# EAGLE design Panel (EAGLE 6.3)

## Sheet 1 of 2
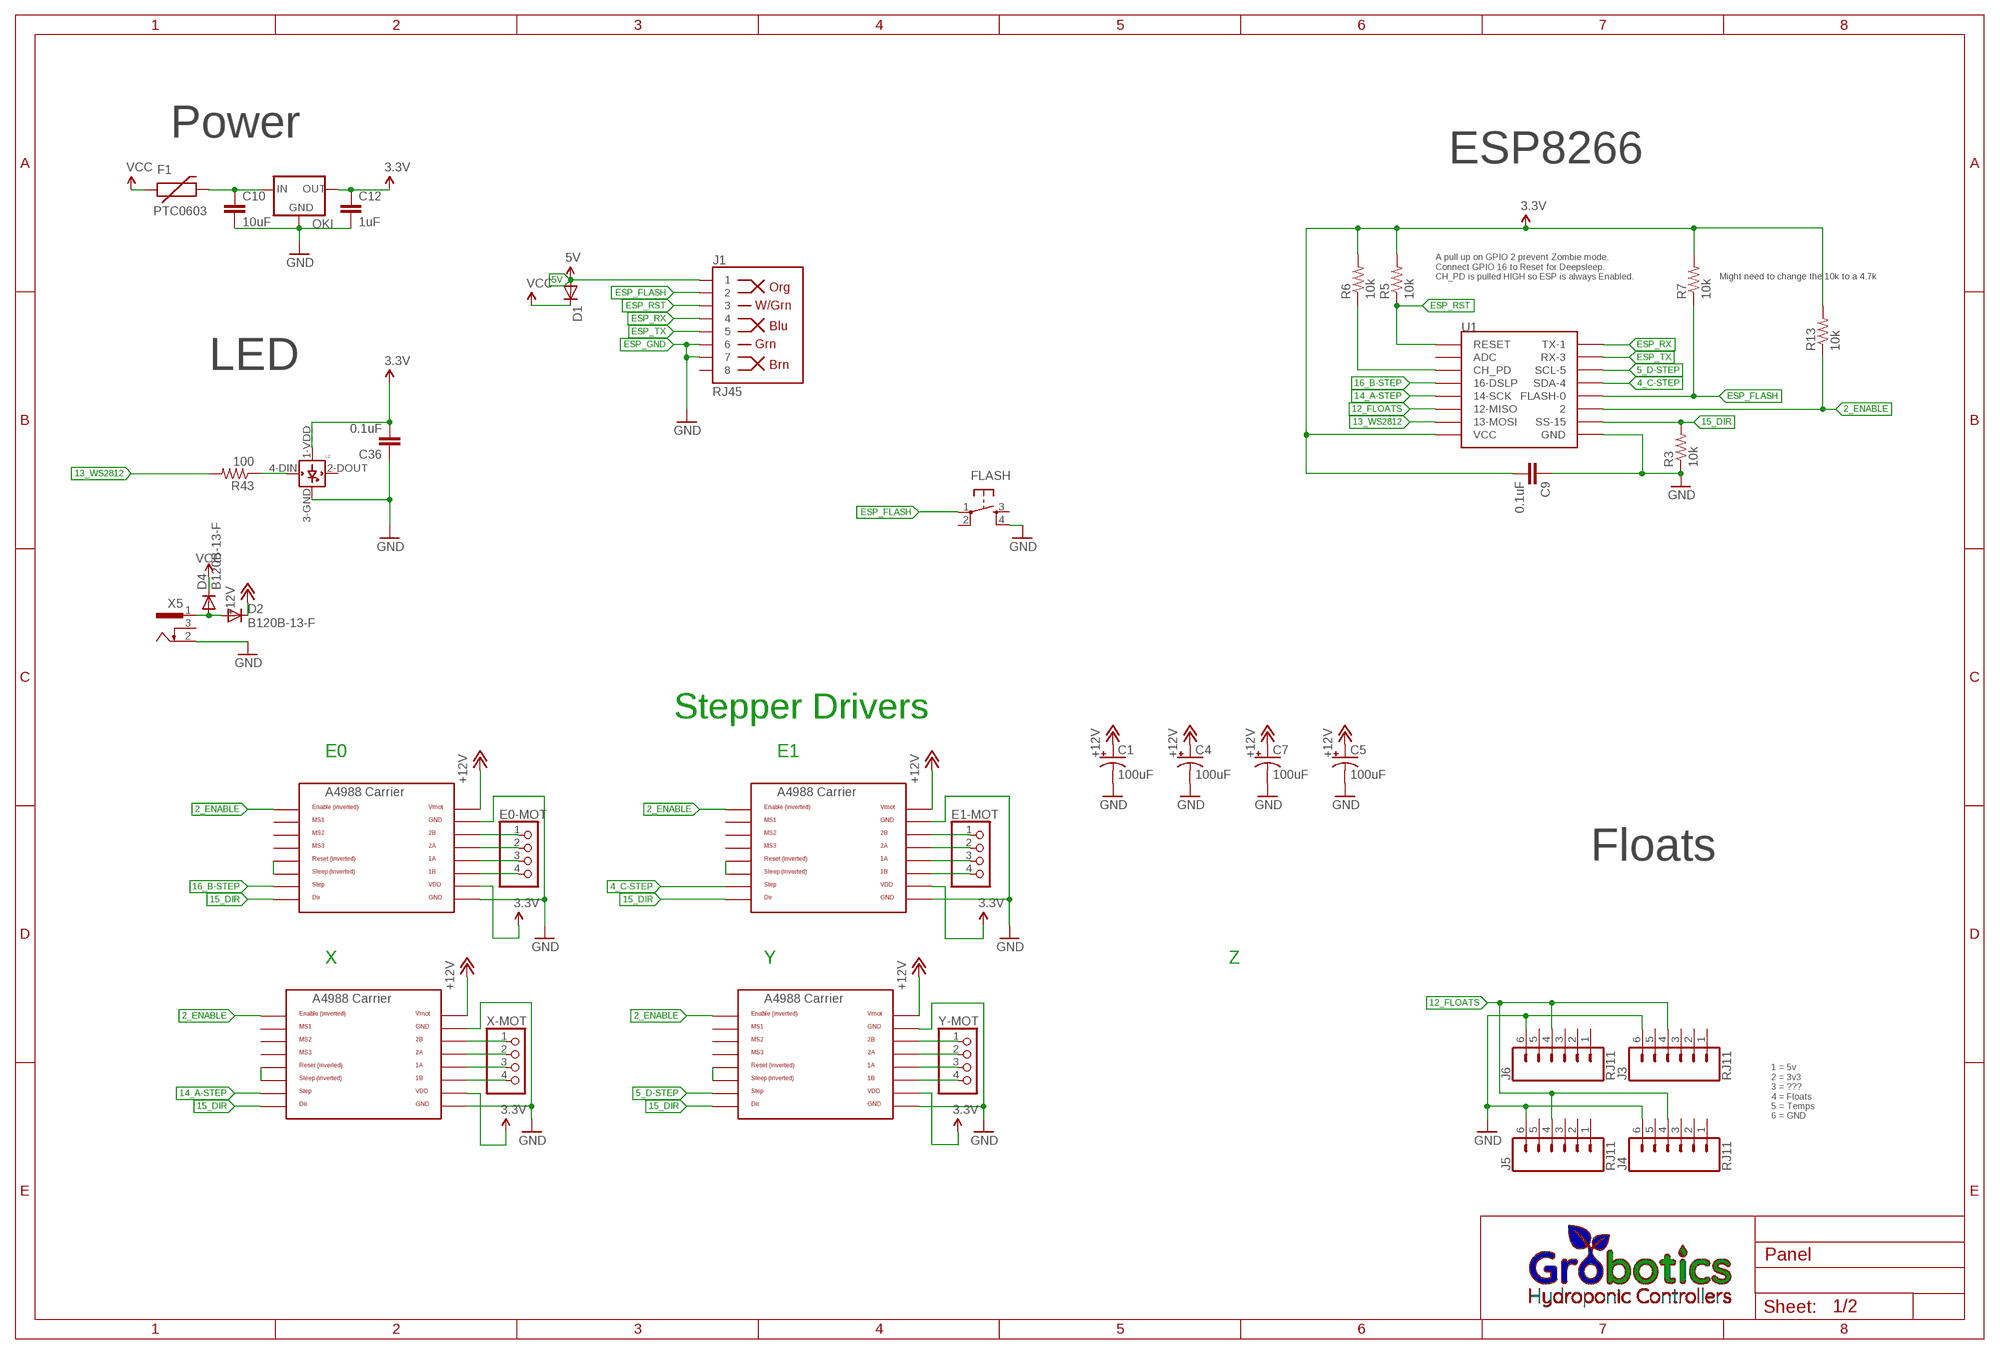
[diagram p0: schematic, sheet 1]

### Parts
C1  100uF  CPOL-US153CLV-0605  [153CLV-0605]
C4  100uF  CPOL-US153CLV-0605  [153CLV-0605]
C5  100uF  CPOL-US153CLV-0605  [153CLV-0605]
C7  100uF  CPOL-US153CLV-0605  [153CLV-0605]
C9  0.1uF  CAP0805  [0805]
C10  10uF  CAP1206  [1206]
C12  1uF  CAP0805  [0805]
C36  0.1uF  CAP0805  [0805]
D1  DIODESOD  [SOD-323]
D2  B120B-13-F  DIODESMB  [SMB-DIODE]
D4  B120B-13-F  DIODESMB  [SMB-DIODE]
E0-MOT  PINHD-1X4  [1X04]
E1-MOT  PINHD-1X4  [1X04]
F1  PTC0603  [0603]
FLASH  TAC_SWITCHSMD  [TACTILE_SWITCH_SMD]
J1  RJ45  RJ45-8  [RJ45-8]
J3  RJ11  RJ11-6  [RJ11-6]
J4  RJ11  RJ11-6  [RJ11-6]
J5  RJ11  RJ11-6  [RJ11-6]
J6  RJ11  RJ11-6  [RJ11-6]
L2  WS2812B  [WS2812B]
OKI  78XXS  [78XXS]
R3  10k  RESISTOR0805  [0805]
R5  10k  RESISTOR0805  [0805]
R6  10k  RESISTOR0805  [0805]
R7  10k  RESISTOR0805  [0805]
R13  10k  RESISTOR0805  [0805]
R43  100  RESISTOR0805  [0805]
U1  ESP12SMD  [ESP12-SMD]
U$1  A4988BREAKOUT  [A4988BREAKOUT]
U$2  LOGO_GROBOTICS-S  [GROBOTICS-S]
U$5  A4988BREAKOUT  [A4988BREAKOUT]
U$6  A4988BREAKOUT  [A4988BREAKOUT]
U$7  A4988BREAKOUT  [A4988BREAKOUT]
X5  733980-62  [733980-62]
X-MOT  PINHD-1X4  [1X04]
Y-MOT  PINHD-1X4  [1X04]

### Nets
2_ENABLE: R13.1 U1.GPIO2 U$1.EN U$5.EN U$6.EN U$7.EN
4_C-STEP: U1.GPIO4(SDA-4) U$5.STEP
5_D-STEP: U1.GPIO5(SCL-5) U$7.STEP
5V: D1.2(A) J1.1
12_FLOATS: J3.4 J4.4 J5.4 J6.4 U1.GPIO12(12-MISO)
13_WS2812: R43.2 U1.GPIO13(13-MOSI)
14_A-STEP: U1.GPIO14(14-SCK) U$6.STEP
15_DIR: R3.2 U1.GPIO15(SS-15) U$1.DIR U$5.DIR U$6.DIR U$7.DIR
16_B-STEP: U1.GPIO16(16-DSLP) U$1.STEP
+12V: C1.+ C4.+ C5.+ C7.+ D2.C U$1.VMOT U$5.VMOT U$6.VMOT U$7.VMOT
ESP_3.3V: C9.2 C12.1 C36.2 L2.1-VDD(VDD) OKI.OUT R5.2 R6.2 R7.2 R13.2 U1.VCC U$1.VDD U$5.VDD U$6.VDD U$7.VDD ; supply symbol labelled 3.3V
ESP_FLASH: FLASH.1 J1.2 R7.1 U1.GPIO0(FLASH-0)
ESP_GND: C1.- C4.- C5.- C7.- C9.1 C10.2 C12.2 C36.1 FLASH.4 J1.6 J1.7 J3.6 J4.6 J5.6 J6.6 L2.3-GND(GND) OKI.GND R3.1 U1.GND U$1.GND U$1.GND@0(GND) U$5.GND U$5.GND@0(GND) U$6.GND U$6.GND@0(GND) U$7.GND U$7.GND@0(GND) X5.2 ; supply symbol labelled GND
ESP_RST: J1.3 R5.1 U1.RESET
ESP_RX: J1.4 U1.TXD0(TX-1)
ESP_TX: J1.5 U1.RXD0(RX-3)
N$1: R6.1 U1.CH_PD
N$3: D2.A D4.A X5.1
N$9: U$1.RST U$1.SLP(SLEEP)
N$18: E0-MOT.1 U$1.2B
N$20: U$6.RST U$6.SLP(SLEEP)
N$21: E0-MOT.2 U$1.2A
N$22: E0-MOT.3 U$1.1A
N$23: U$7.RST U$7.SLP(SLEEP)
N$24: U$5.RST U$5.SLP(SLEEP)
N$26: E0-MOT.4 U$1.1B
N$27: E1-MOT.1 U$5.2B
N$28: E1-MOT.2 U$5.2A
N$32: E1-MOT.3 U$5.1A
N$36: E1-MOT.4 U$5.1B
N$37: U$6.2B X-MOT.1
N$38: U$6.2A X-MOT.2
N$39: U$6.1A X-MOT.3
N$40: U$6.1B X-MOT.4
N$41: U$7.2B Y-MOT.1
N$42: U$7.2A Y-MOT.2
N$43: U$7.1A Y-MOT.3
N$44: U$7.1B Y-MOT.4
N$45: C10.1 F1.2 OKI.IN
N$74: L2.4-DIN(DIN) R43.1
VCC: D1.1(C) D4.C F1.1
Unconnected: FLASH.2 FLASH.3 J1.8 J3.1 J3.2 J3.3 J3.5 J4.1 J4.2 J4.3 J4.5 J5.1 J5.2 J5.3 J5.5 J6.1 J6.2 J6.3 J6.5 L2.2-DOUT(DOUT) U1.ADC U$1.MS1 U$1.MS2 U$1.MS3 U$5.MS1 U$5.MS2 U$5.MS3 U$6.MS1 U$6.MS2 U$6.MS3 U$7.MS1 U$7.MS2 U$7.MS3 X5.3

### Notes on the sheet
- Power
- ESP8266
- A pull up on GPIO 2 prevent Zombie mode.
  Connect GPIO 16 to Reset for Deepsleep.
  CH_PD is pulled HIGH so ESP is always Enabled.
- Might need to change the 10k to a 4.7k
- LED
- Stepper Drivers
- E0 | E1
- Floats
- X | Y | Z
- 1 = 5v
  2 = 3v3
  3 = ???
  4 = Floats
  5 = Temps
  6 = GND

## Sheet 2 of 2
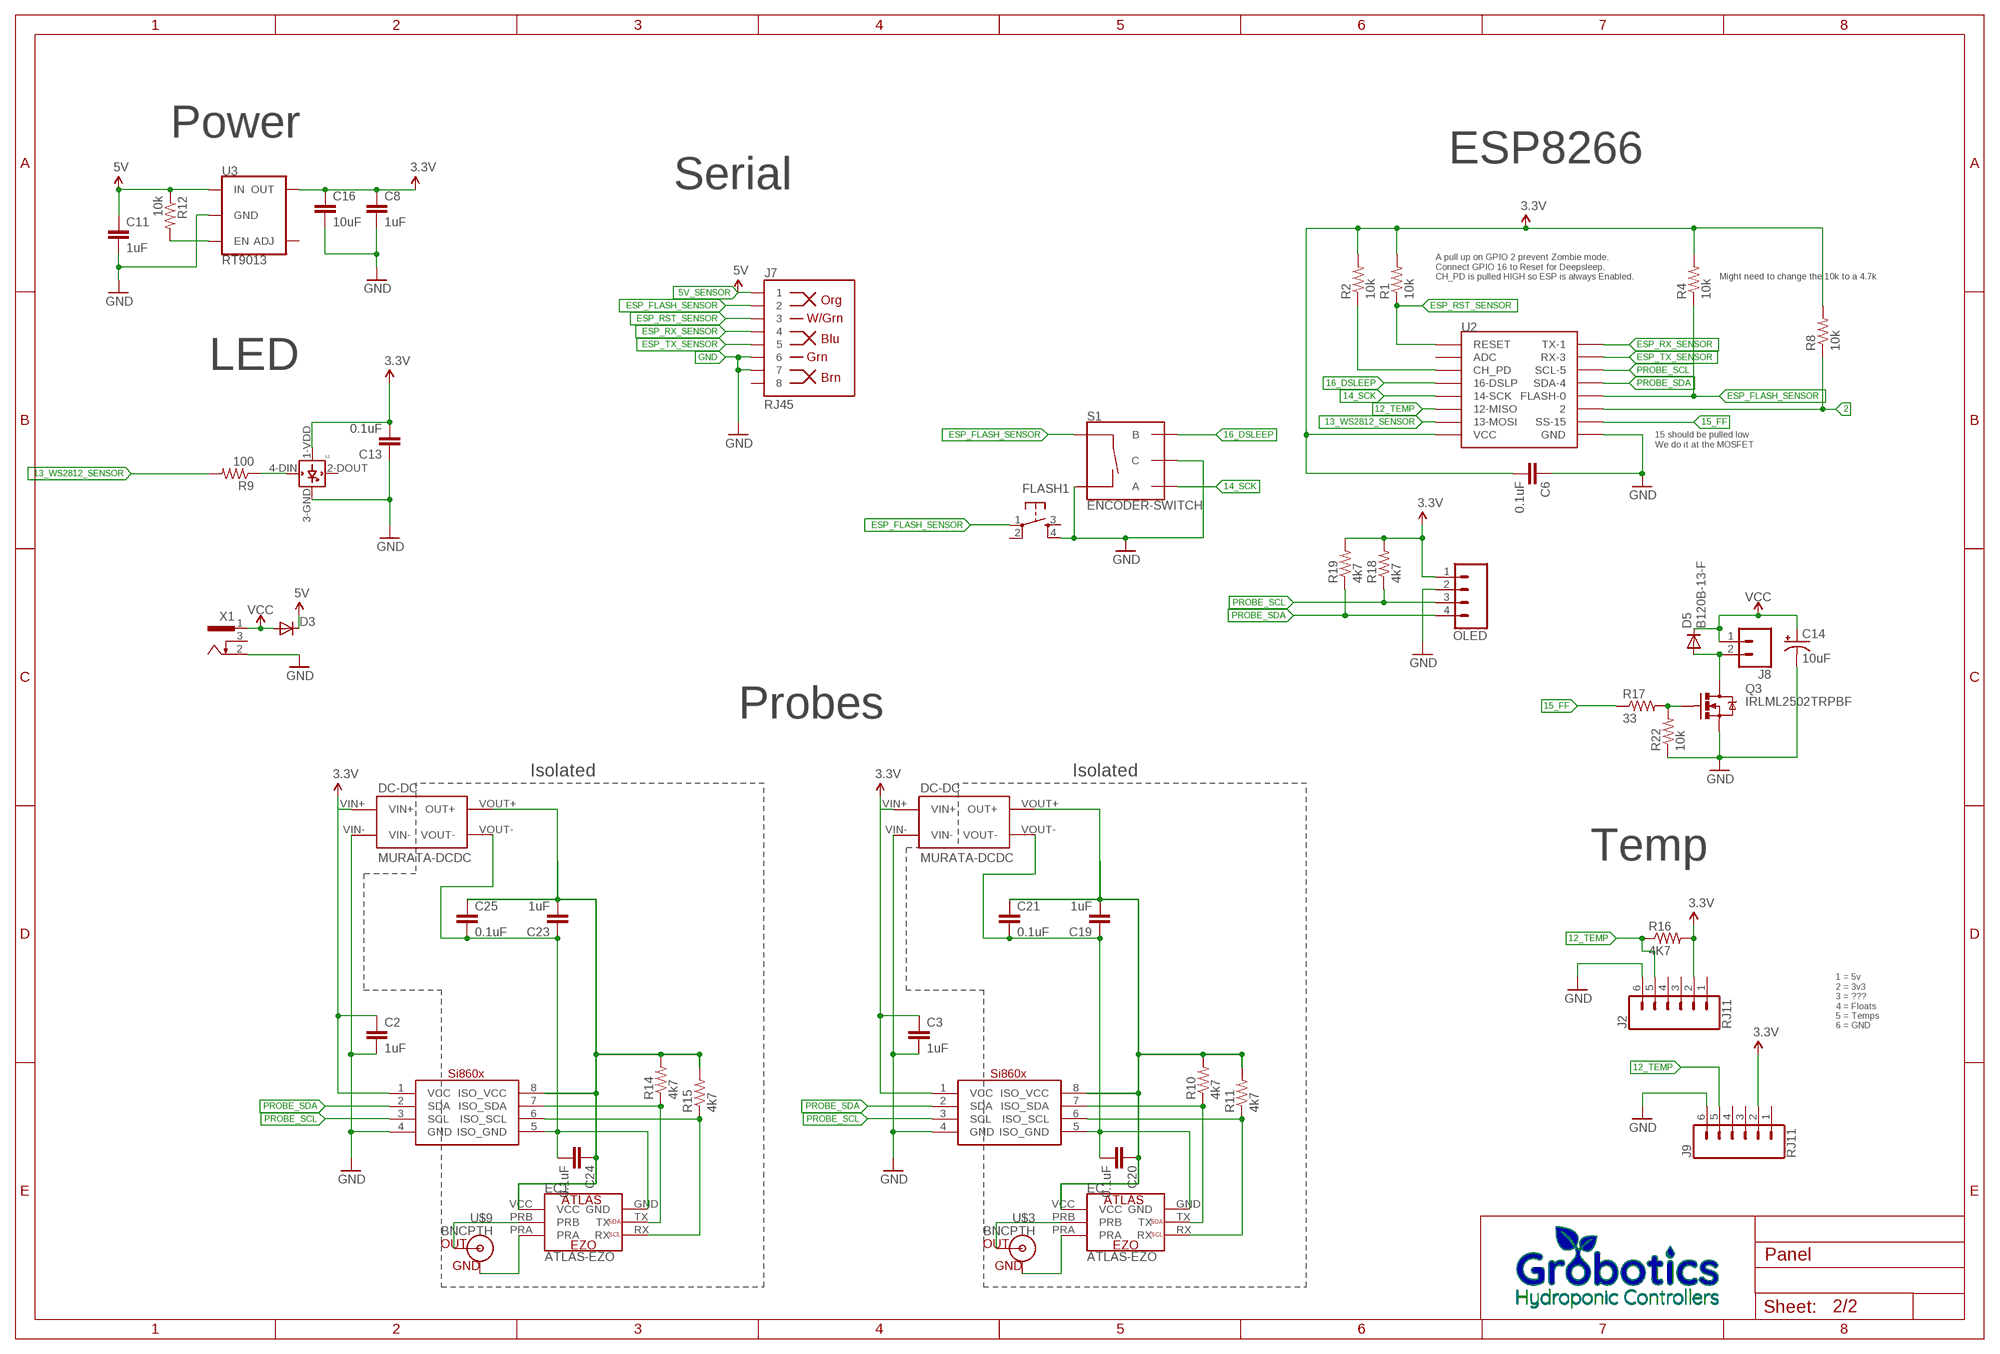
[diagram p1: schematic, sheet 2]

### Parts
C2  1uF  CAP0805  [0805]
C3  1uF  CAP0805  [0805]
C6  0.1uF  CAP0805  [0805]
C8  1uF  CAP0805  [0805]
C11  1uF  CAP0805  [0805]
C13  0.1uF  CAP0805  [0805]
C14  10uF  CPOL-US153CLV-0405  [153CLV-0405]
C16  10uF  CAP0805  [0805]
C19  1uF  CAP0805  [0805]
C20  0.1uF  CAP0805  [0805]
C21  0.1uF  CAP0805  [0805]
C23  1uF  CAP0805  [0805]
C24  0.1uF  CAP0805  [0805]
C25  0.1uF  CAP0805  [0805]
D3  DIODESOD  [SOD-323]
D5  B120B-13-F  DIODESMB  [SMB-DIODE]
EC  ATLAS-EZO  [ATLAS-EZO]
EC1  ATLAS-EZO  [ATLAS-EZO]
FLASH1  TAC_SWITCHSMD  [TACTILE_SWITCH_SMD]
J2  RJ11  RJ11-6  [RJ11-6]
J7  RJ45  RJ45-8  [RJ45-8]
J8  CONN_02  [1X02]
J9  RJ11  RJ11-6  [RJ11-6]
L1  WS2812B  [WS2812B]
OLED  CONN_04  [1X04]
Q3  IRLML2502TRPBF  MOSFET-NCHANNELSMD  [SOT23-3]
R1  10k  RESISTOR0805  [0805]
R2  10k  RESISTOR0805  [0805]
R4  10k  RESISTOR0805  [0805]
R8  10k  RESISTOR0805  [0805]
R9  100  RESISTOR0805  [0805]
R10  4k7  RESISTOR0805-RES  [0805]
R11  4k7  RESISTOR0805-RES  [0805]
R12  10k  RESISTOR0805  [0805]
R14  4k7  RESISTOR0805-RES  [0805]
R15  4k7  RESISTOR0805-RES  [0805]
R16  4K7  RESISTOR0805-RES  [0805]
R17  33  RESISTOR0805  [0805]
R18  4k7  RESISTOR0805  [0805]
R19  4k7  RESISTOR0805  [0805]
R22  10k  RESISTOR0805  [0805]
S1  ENCODER-SWITCH  [ROTARY_ENC_PLAIN]
U2  ESP12SMD  [ESP12-SMD]
U3  RT9013  AP2202-ADJ  [SOT23-5]
U$3  BNCPTH  [BNC]
U$4  MURATA-DCDC  [MURATA_DCDC]
U$8  SI860X  [SO08]
U$9  BNCPTH  [BNC]
U$11  SI860X  [SO08]
U$12  LOGO_GROBOTICS  [GROBOTICS]
U$14  MURATA-DCDC  [MURATA_DCDC]
X1  733980-62  [733980-62]

### Nets
2: R8.1 U2.GPIO2
3.3V: C2.1 C3.1 C6.2 C8.1 C13.2 C16.1 J2.2 J9.2 L1.1-VDD(VDD) OLED.1 R1.2 R2.2 R4.2 R8.2 R16.2 R18.2 R19.2 U2.VCC U3.5(OUT) U$4.VIN+ U$8.1(VCC) U$11.1(VCC) U$14.VIN+
5V_SENSOR: C11.1 D3.1(C) J7.1 R12.1 U3.1(IN) ; supply symbol labelled 5V
12_TEMP: J2.5 J9.5 R16.1 U2.GPIO12(12-MISO)
13_WS2812_SENSOR: R9.2 U2.GPIO13(13-MOSI)
14_SCK: S1.A U2.GPIO14(14-SCK)
15_FF: R17.1 U2.GPIO15(SS-15)
16_DSLEEP: S1.B U2.GPIO16(16-DSLP)
ESP_FLASH_SENSOR: FLASH1.1 J7.2 R4.1 S1.SW+ U2.GPIO0(FLASH-0)
ESP_RST_SENSOR: J7.3 R1.1 U2.RESET
ESP_RX_SENSOR: J7.4 U2.TXD0(TX-1)
ESP_TX_SENSOR: J7.5 U2.RXD0(RX-3)
GND: C2.2 C3.2 C6.1 C8.2 C11.2 C13.1 C14.- C16.2 FLASH1.4 J2.6 J7.6 J7.7 J9.6 L1.3-GND(GND) OLED.2 Q3.2(S) R22.1 S1.C S1.SW- U2.GND U3.2(GND) U$4.VIN- U$8.4(GND) U$11.4(GND) U$14.VIN- X1.2
N$2: EC.PRB U$3.S(OUT)
N$4: EC1.PRB U$9.S(OUT)
N$5: EC1.PRA U$9.GND
N$6: EC1.RX R15.1 U$11.6(ISO_SCL)
N$7: EC1.TX R14.1 U$11.7(ISO_SDA)
N$8: EC.PRA U$3.GND
N$10: R2.1 U2.CH_PD
N$11: L1.4-DIN(DIN) R9.1
N$12: EC.RX R11.1 U$8.6(ISO_SCL)
N$13: R12.2 U3.3(EN)
N$14: EC.TX R10.1 U$8.7(ISO_SDA)
N$15: C19.1 C20.2 C21.2 EC.GND U$4.VOUT- U$8.5(ISO_GND)
N$16: C19.2 C20.1 C21.1 EC.VCC R10.2 R11.2 U$4.VOUT+(OUT+) U$8.8(ISO_VCC)
N$17: C23.1 C24.2 C25.2 EC1.GND U$11.5(ISO_GND) U$14.VOUT-
N$19: Q3.1(G) R17.2 R22.2
N$25: C23.2 C24.1 C25.1 EC1.VCC R14.2 R15.2 U$11.8(ISO_VCC) U$14.VOUT+(OUT+)
N$29 [power]: D5.A J8.2 Q3.3(D)
PROBE_SCL: OLED.3 R18.1 U2.GPIO5(SCL-5) U$8.3(SCL) U$11.3(SCL)
PROBE_SDA: OLED.4 R19.1 U2.GPIO4(SDA-4) U$8.2(SDA) U$11.2(SDA)
VCC_SENSOR: C14.+ D3.2(A) D5.C J8.1 X1.1 ; supply symbol labelled VCC
Unconnected: FLASH1.2 FLASH1.3 J2.1 J2.3 J2.4 J7.8 J9.1 J9.3 J9.4 L1.2-DOUT(DOUT) U2.ADC U3.4(ADJ) X1.3

### Notes on the sheet
- Power
- ESP8266
- Serial
- A pull up on GPIO 2 prevent Zombie mode.
  Connect GPIO 16 to Reset for Deepsleep.
  CH_PD is pulled HIGH so ESP is always Enabled.
- Might need to change the 10k to a 4.7k
- LED
- 15 should be pulled low
  We do it at the MOSFET
- Probes
- Isolated | Isolated
- Temp
- 1 = 5v
  2 = 3v3
  3 = ???
  4 = Floats
  5 = Temps
  6 = GND

## Library data of the parts
C1 C4 C5 C7 C14 = adafruit:CPOL-US: POLARIZED CAPACITOR, American symbol
C2 C3 C6 C8-C13 C16 C19-C21 C23-C25 C36 = SparkFun-Capacitors:CAP: Capacitor Standard 0603 ceramic capacitor, and 0.1" leaded capacitor.
D1-D5 = SparkFun-DiscreteSemi:DIODE: Diode These are standard reverse protection diodes and small signal diodes. SMA package can handle up to about 1A. SOD-323 can handle about 200mA. What the SOD-323 package when ordering, there are some mfgs out there that are 5-pin packages.
E0-MOT E1-MOT X-MOT Y-MOT = RepRapjr:PINHD-1X4: PIN HEADER
EC EC1 = 1_Skips:ATLAS-EZO: Atlas Scientific Modules EC, pH, DO http://www.atlas-scientific.com/
F1 = SparkFun-PowerIC:PTC: Resettable Fuse PTC Resettable Fuse. Spark Fun Electronics SKU : COM-08357
FLASH FLASH1 = SparkFun-Electromechanical:TAC_SWITCH: Momentary Switch Button commonly used for reset or general input. Spark Fun Electronics SKU : COM-00097 SMT- SWCH-08247; PROD_ID: SWCH-08247
J1 J7 = SparkFun-Connectors:RJ45-8: RJ45 Jack - 8 pin Simple RJ45, 8-pin connection. Commonly used for Cat5, Cat5e, and Cat6 Ethernet cables. Here is the connector we sell at SparkFun: RJ45 8-Pin Connector <https://www.sparkfun.com/products/643> (PRT-00643) Datasheet <https://cdn.sparkfun.com/datasheets/Prototyping/04908.pdf> It is used on this SparkFun product: SparkFun RJ45 Breakout <https://www.sparkfun.com/products/716> (BOB-00716) Note, you may also be interested in the "MAGJACK" version of this. It is basically a RJ45 connector, but also has some status LEDs built into the connector housing. You can check that out in this library at the device named "MAGJACK.dev" and see these products online: RJ45 Ethernet MagJack-Compatible <https://www.sparkfun.com/products/8534> (PRT-08534) SparkFun RJ45 MagJack Breakout <https://www.sparkfun.com/products/13021> (BOB-13021); PROD_ID: CONN-08506; SF_ID: PRT-00643
J2-J6 J9 = SparkFun-Connectors:RJ11-6: RJ11 Jack - 6 pin Commonly found on CAT3 devices and some Microchip programmers. Here is the connector we sell at SparkFun: RJ11 6-Pin Connector <https://www.sparkfun.com/products/132> (PRT-00132) Datasheet <http://www.sparkfun.com/datasheets/Prototyping/Connectors/RJ11-Datasheet.pdf> It is used on this SparkFun product: SparkFun Weather Shield <https://www.sparkfun.com/products/12081> (DEV-12081) Weather Meters <https://www.sparkfun.com/products/8942> (SEN-08942); PROD_ID: CONN-08590; SF_ID: PRT-00132
J8 = SparkFun-Connectors:CONN_02: Multi connection point. Often used as Generic Header-pin footprint for 0.1 inch spaced/style header connections On any of the 0.1 inch spaced packages, you can populate with these: Break Away Headers - Straight <https://www.sparkfun.com/products/116> (PRT-00116) Break Away Male Headers - Right Angle <https://www.sparkfun.com/products/553> (PRT-00553) Female Headers <https://www.sparkfun.com/products/115> (PRT-00115) Break Away Headers - Machine Pin <https://www.sparkfun.com/products/117> (PRT-00117) Break Away Female Headers - Swiss Machine Pin <https://www.sparkfun.com/products/743> (PRT-00743) For SCREWTERMINALS and SPRING TERMINALS visit here: Screw Terimnals on SparkFun.com <https://www.sparkfun.com/search/results?term=Screw+Terminals> (5mm/3.5mm/2.54mm spacing) This device is also useful as a general connection point to wire up your design to another part of your project. Our various solder wires solder well into these plated through hole pads. Hook-Up Wire - Assortment (Stranded, 22 AWG) <https://www.sparkfun.com/products/11375> (PRT-11375) Hook-Up Wire - Assortment (Solid Core, 22 AWG) <https://www.sparkfun.com/products/11367> (PRT-11367) View the entire wire category on our website here <https://www.sparkfun.com/categories/141> Special notes: Molex polarized connector foot print use with: PRT-08233 with associated crimp pins and housings. 2.54_SCREWTERM for use with PRT-10571. 3.5mm Screw Terminal footprints for PRT-08084 5mm Screw Terminal footprints for use with PRT-08432
L1 L2 = adafruit:WS2812B
OKI = v-reg:78XXS: VOLTAGE REGULATOR
OLED = SparkFun-Connectors:CONN_04: Multi connection point. Often used as Generic Header-pin footprint for 0.1 inch spaced/style header connections On any of the 0.1 inch spaced packages, you can populate with these: Break Away Headers - Straight <https://www.sparkfun.com/products/116> (PRT-00116) Break Away Male Headers - Right Angle <https://www.sparkfun.com/products/553> (PRT-00553) Female Headers <https://www.sparkfun.com/products/115> (PRT-00115) Break Away Headers - Machine Pin <https://www.sparkfun.com/products/117> (PRT-00117) Break Away Female Headers - Swiss Machine Pin <https://www.sparkfun.com/products/743> (PRT-00743) For SCREWTERMINALS and SPRING TERMINALS visit here: Screw Terimnals on SparkFun.com <https://www.sparkfun.com/search/results?term=Screw+Terminals> (5mm/3.5mm/2.54mm spacing) This device is also useful as a general connection point to wire up your design to another part of your project. Our various solder wires solder well into these plated through hole pads. Hook-Up Wire - Assortment (Stranded, 22 AWG) <https://www.sparkfun.com/products/11375> (PRT-11375) Hook-Up Wire - Assortment (Solid Core, 22 AWG) <https://www.sparkfun.com/products/11367> (PRT-11367) View the entire wire category on our website here <https://www.sparkfun.com/categories/141> Special notes: Molex polarized connector foot print use with SKU : PRT-08231 with associated crimp pins and housings. 1MM SMD Version SKU: PRT-10208; PROD_ID: CONN-09696
Q3 = freetronics-master-v1.1:MOSFET-NCHANNEL
R1-R9 R12 R13 R17-R19 R22 R43 = LowPowerLab:RESISTOR: Resistor Basic schematic elements and footprints for 0603, 1206, and PTH resistors.
R10 R11 R14-R16 = SparkFun-Resistors:RESISTOR: Resistor Basic schematic elements and footprints for 0603, 1206, and PTH resistors.
S1 = SparkFun-Switches:ENCODER-SWITCH: Rotary Encoder w/ Select Switch Encoders rotate similarly to potentiometers, but they’re different from potentiometers in that an encoder has full rotation without limits. They output gray code so that you can tell how much and in which direction the encoder has been turned. This encoder includes a push-down select switch built into the shaft. SparkFun Products Rotary Encoder <https://www.sparkfun.com/products/9117> (COM-09117); SF_SKU: COM-09117
U1 U2 = esp8266modules:ESP12: ESP8266 Wifi module 12
U3 = SparkFun-IC-Power:AP2202-ADJ: AP2202 Adjustable LDO Diodes Inc small, low-cost LDO 150mA, 13.2V, less than 200mV dropout; PROD_ID: VREG-12189; VALUE: AP2202-ADJ
U$1 U$5-U$7 = RepRapjr:A4988BREAKOUT
U$2 = 1_Skips:LOGO_GROBOTICS-S
U$3 U$9 = SparkFun-Connectors:BNC: BNC Connector, Mouser Part# 5227161
U$4 U$14 = 11_Skips_Refactor:MURATA-DCDC: Isolated DC-DC convertor by Murata Recommend: 22uH/10uF LC filter on OUTPUT 4.7uF/15uH LC filter on INPUT LOAD HAS TO BE > 10% OF RATED POWER http://power.murata.com/data/power/ncl/kdc_nxe2.pdf
U$8 U$11 = 1_Skips:SI860X: Silicon Labs - Si860x http://au.element14.com/silicon-labs/si8600ab-b-is/digital-isolator-20ns-nsoic-8/dp/2423221 The SI8600AB-B-IS is a bidirectional I²C Isolator with unidirectional digital channels. It is designed based on Silicon Labs proprietary RF isolation technology and offers shorter propagation delays, lower power consumption, smaller installed size and more stable operation with temperature and age versus optocouplers or other digital isolators. It includes hot-swap bidirectional SDA and/or SCL isolation channels with open-drain, 35mA sink capability that operate to a maximum frequency of 1.7MHz. It contains protection circuits to guard against data errors when an unpowered device is inserted into a powered system. Small size, low installed cost, low power consumption and short propagation delays make the Si860x family the optimum solution for isolating I²C and SMBus serial ports. Independent bidirectional SDA and SCL isolation channels Open drain outputs with 35mA sink current Up to 5000VRMS isolation 60-year Life at rated working voltage High electromagnetic immunity (EMI) Transient immunity 50 kV/µs AEC Qualified
U$12 = 1_Skips:LOGO_GROBOTICS
X1 X5 = con-conrad:73398?: FEMALE PRINT CONNECTOR Niedervolt-Steckverbinder Distributor Conrad

## Net classes
1 power: width 0.381 mm, clearance 0.254 mm

## Board
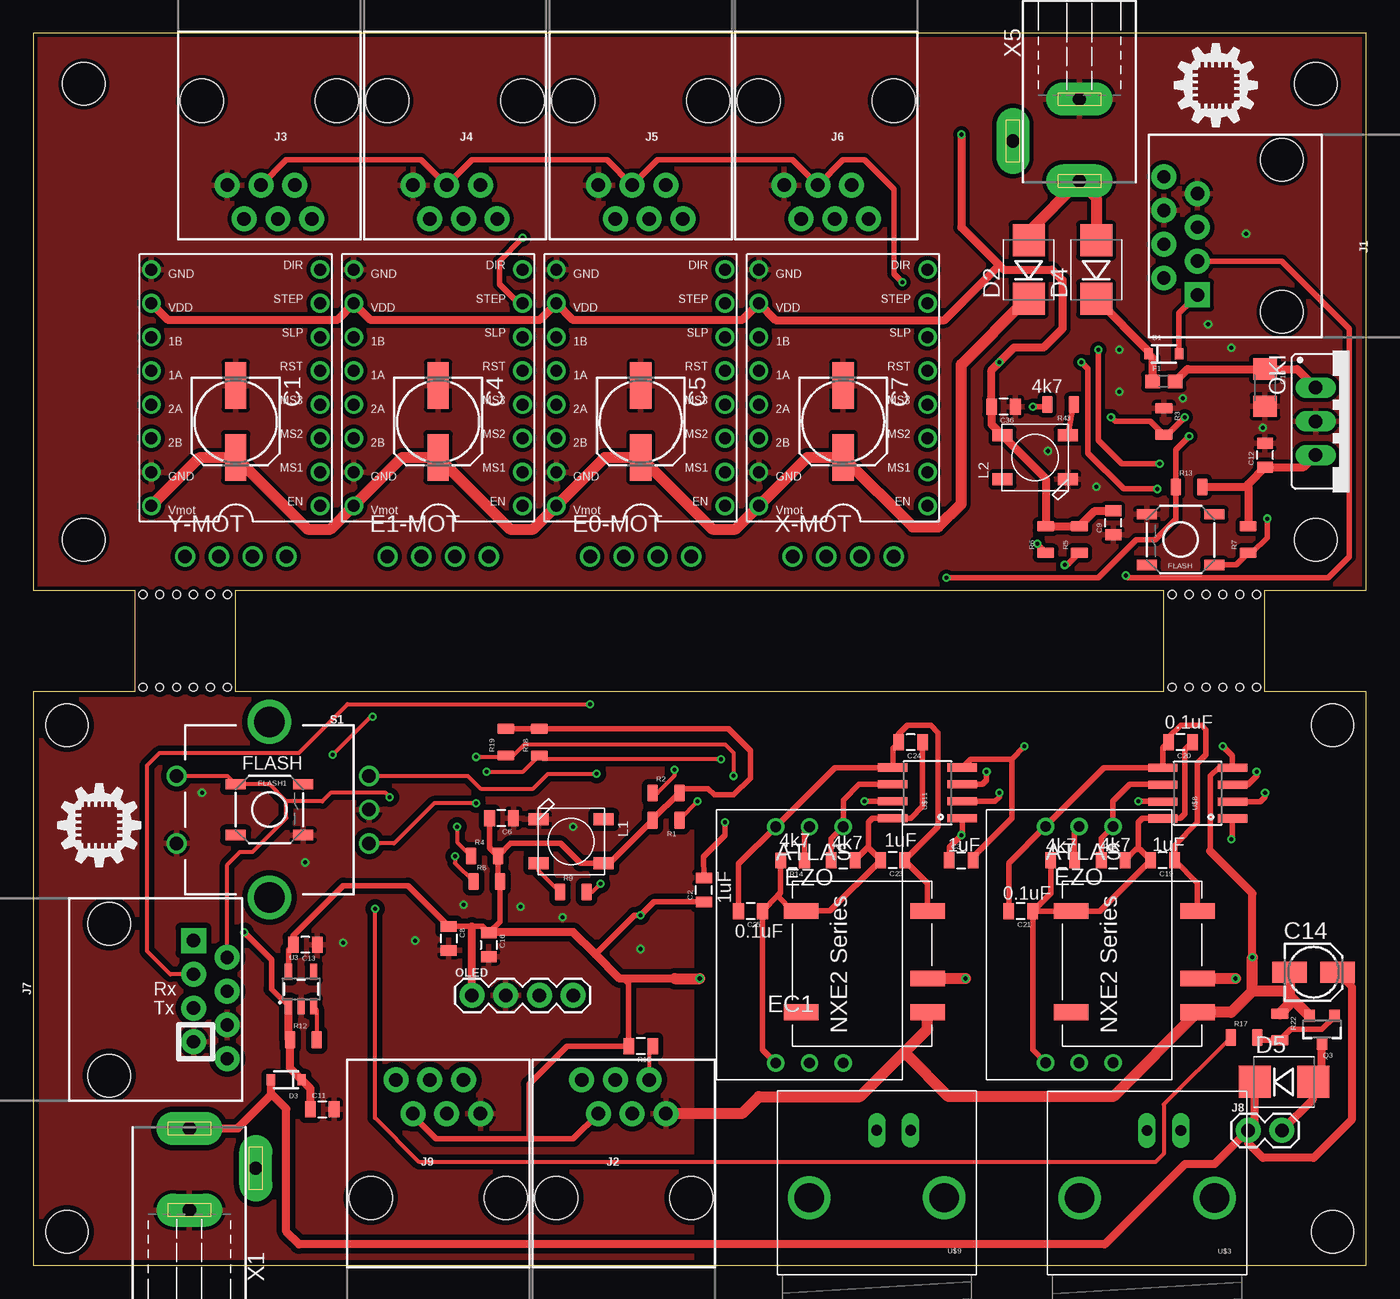
[diagram p2: board, top side]
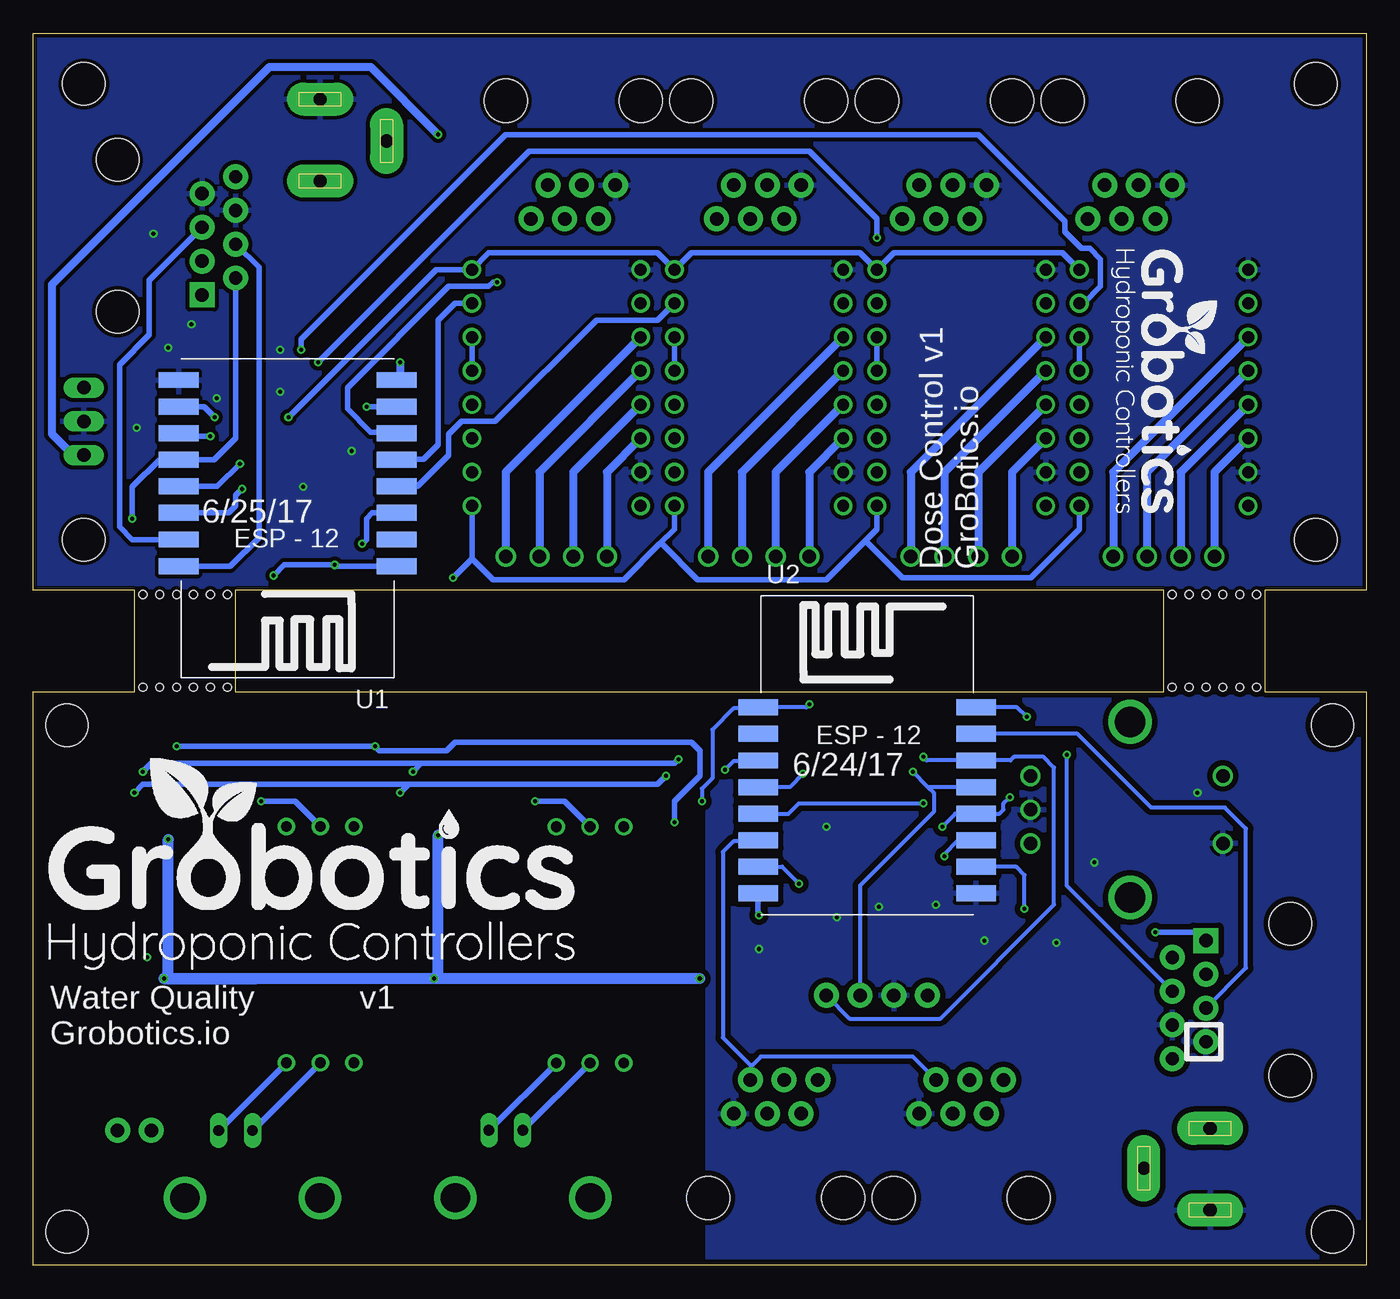
[diagram p3: board, bottom side, seen from below]

Size 100.33 x 92.71 mm. Coordinates in mm from the lower left corner, seen from the top.
Outline: 100.33,92.71 0,92.71 0,50.8 7.62,50.8 7.62,43.18 0,43.18 0,0 100.33,0 100.33,43.18 92.71,43.18 92.71,50.8 100.33,50.8 100.33,92.71
Outline: 15.24,50.8 85.09,50.8 85.09,43.18 15.24,43.18 15.24,50.8
Copper layers (1*16): Top 0.035mm / dielectric 1.5mm / Bottom 0.035mm
Design rules "dirt_cheap_dirty_boards.v1": minimum track width 5mil, minimum drill 12mil, track to track 5mil, track to pad 5mil, pad to pad 5mil, via to via 5mil, smd to smd 0mil, copper to edge 10mil, drill to drill 10mil, minimum pad ring 10mil, minimum via ring 6mil, stop-mask expansion 2mil, vias tented up to drill 25mil, thermal gap 10mil
Holes 3.2 mm at 96.52,88.9 3.81,88.9 3.81,54.61 96.52,54.61 2.54,2.54 97.79,2.54 97.79,40.64 2.54,40.64
Holes 0.6 mm at 8.26,50.48 9.53,50.48 10.79,50.48 12.06,50.48 13.34,50.48 14.61,50.48 8.26,43.5 9.53,43.5 10.79,43.5 12.06,43.5 13.34,43.5 14.61,43.5 85.72,50.48 87,50.48 88.27,50.48 89.53,50.48 90.81,50.48 92.08,50.48 85.72,43.5 87,43.5 88.27,43.5 89.53,43.5 90.81,43.5 92.08,43.5

### Footprints (pad centres in the part's own frame; a part is rotated, then mirrored left to right if it is on the bottom)
153CLV-0605 = smd 3.5 x 1.6: + 2.7,0; - -2.7,0
0805 = smd 0.8 x 1.2: 1 -0.9,0; 2 0.9,0
1206 = smd 1.6 x 1.8: 1 -1.4,0; 2 1.4,0
153CLV-0405 = smd 2.6 x 1.6: + 1.8,0; - -1.8,0
SOD-323 = smd 0.63 x 0.83: 1 -1.15,0; 2 1.15,0
SMB-DIODE = smd 2.4 x 2.4: A 2.2,0; C -2.2,0
1X04 = drill 1.016: 1 -2.54,0; 2 0,0; 3 2.54,0; 4 5.08,0
ATLAS-EZO = drill 0.8: GND -2.54,8.89; PRA 2.54,-8.89; PRB 0,-8.89; RX 2.54,8.89; TX 0,8.89; VCC -2.54,-8.89
0603 = smd 1.1 x 1: 1 -0.85,0; 2 0.85,0
TACTILE_SWITCH_SMD = smd 1.524 x 0.762: 1 -2.54,1.905; 2 2.54,1.905; 3 -2.54,-1.905; 4 2.54,-1.905
RJ45-8 = drill 1 pad 1.88 square: 1 -4.445,6.35 | drill 1 pad 1.88: 2 -3.175,8.89; 3 -1.905,6.35; 4 -0.635,8.89; 5 0.635,6.35; 6 1.905,8.89; 7 3.175,6.35; 8 4.445,8.89 | hole 3.2: -5.715,0; 5.715,0
RJ11-6 = drill 1.016 pad 1.88: 1 -3.175,8.89; 2 -1.905,6.35; 3 -0.635,8.89; 4 0.635,6.35; 5 1.905,8.89; 6 3.175,6.35 | hole 3.251: -5.08,0; 5.08,0
1X02 = drill 1.016 pad 1.88: 1 0,0; 2 2.54,0
WS2812B = smd 1.5 x 0.9: 1-VDD 2.45,-1.65; 2-DOUT 2.45,1.65; 3-GND -2.45,1.65; 4-DIN -2.45,-1.65
78XXS = drill 1.016 long: GND 0,-2.54; IN -2.54,-2.54; OUT 2.54,-2.54
1X04' = drill 1.016 pad 1.88: 1 0,0; 2 2.54,0; 3 5.08,0; 4 7.62,0
SOT23-3 = smd 0.8 x 0.9: 1 -0.95,-1; 2 0.95,-1; 3 0,1.1
0805' = smd 0.8 x 1.3: 1 -1,0; 2 1,0
ROTARY_ENC_PLAIN = drill 1.016: A 7.493,-2.54; B 7.493,2.54; C 7.493,0; SW+ -6.985,2.54; SW- -6.985,-2.54 | drill 2.286: P$3 0,6.604; P$4 0,-6.604
ESP12-SMD = smd 3 x 1.2: ADC -8.3,3.8; CH_PD -8.3,1.8; GND 8.1,-8.2; GPIO0 8.1,-2.2; GPIO2 8.1,-4.2; GPIO4 8.1,1.8; GPIO5 8.1,-0.2; GPIO12 -8.3,-4.2; GPIO13 -8.3,-6.2; GPIO14 -8.3,-2.2; GPIO15 8.1,-6.2; GPIO16 -8.3,-0.2; RESET -8.3,5.8; RXD0 8.1,3.8; TXD0 8.1,5.8; VCC -8.3,-8.2
SOT23-5 = smd 0.55 x 1.2: 1 -0.95,-1.3; 2 0,-1.3; 3 0.95,-1.3; 4 0.95,1.3; 5 -0.95,1.3
A4988BREAKOUT = drill 0.9: 1A 8.89,1.27; 1B 11.43,1.27; 2A 6.35,1.27; 2B 3.81,1.27; DIR 16.51,-11.43; EN -1.27,-11.43; GND 16.51,1.27; GND@0 1.27,1.27; MS1 1.27,-11.43; MS2 3.81,-11.43; MS3 6.35,-11.43; RST 8.89,-11.43; SLP 11.43,-11.43; STEP 13.97,-11.43; VDD 13.97,1.27; VMOT -1.27,1.27
BNC = drill 2.2: 3 -5.08,5.08; 4 5.08,5.08 | drill 0.8 long: GND -2.54,0; S 0,0
MURATA_DCDC = smd 1.2 x 2.6: NC 0,9.525; VIN+ 2.54,0; VIN- 0,0; VOUT+ 7.62,9.525; VOUT- 7.62,0
SO08 = smd 0.61 x 2.21: 1 -1.905,-2.616; 2 -0.635,-2.616; 3 0.635,-2.616; 4 1.905,-2.616; 5 1.905,2.616; 6 0.635,2.616; 7 -0.635,2.616; 8 -1.905,2.616
733980-62 = drill 1 pad 2.5 long: 1 0,8.57; 2 0,2.42; 3 5,5.57

### Placement (x,y rotation side)
C1  15.24,63.5 270 top
C2  50.48,28.26 90 top
C3  69.85,30.48 0 top
C4  30.48,63.5 270 top
C5  45.72,63.5 270 top
C6  35.24,33.66 180 top
C7  60.96,63.5 270 top
C8  31.27,24.61 270 top
C9  81.28,55.88 90 top
C10  92.71,66.04 270 top
C11  21.75,11.75 0 top
C12  92.71,60.96 90 top
C13  20.48,24.13 180 top
C14  96.36,22.07 0 top
C16  34.29,24.13 270 top
C19  85.01,30.49 180 top
C20  86.34,39.37 180 top
C21  74.32,26.66 180 top
C23  64.69,30.49 180 top
C24  66.03,39.37 180 top
C25  53.98,26.66 180 top
C36  73.03,64.61 180 top
D1  85.09,68.58 0 top
D2  74.93,74.93 90 top
D3  19.05,13.97 180 top
D4  80.01,74.93 90 top
D5  94.14,13.81 0 top
E0-MOT  44.45,53.34 0 top
E1-MOT  29.21,53.34 0 top
EC  78.73,24.14 0 top
EC1  58.42,24.12 0 top
F1  85.09,66.52 0 top
FLASH  86.36,54.61 180 top
FLASH1  17.78,34.29 0 top
J1  93.98,77.47 90 top
J2  44.45,5.08 0 top
J3  17.78,87.63 180 top
J4  31.75,87.63 180 top
J5  45.72,87.63 180 top
J6  59.69,87.63 180 top
J7  5.71,20 270 top
J8  91.44,10.16 0 top
J9  30.48,5.08 0 top
L1  40.48,31.91 0 top
L2  75.41,60.8 180 top
OKI  99.06,63.5 270 top
OLED  [1X04']  33.02,20.32 0 top
Q3  97,17.78 180 top
R1  10k  [0805']  47.62,33.5 180 top
R2  10k  [0805']  47.62,35.56 0 top
R3  10k  [0805']  85.09,63.5 270 top
R4  10k  [0805']  33.97,30.8 0 top
R5  10k  [0805']  78.74,54.61 90 top
R6  10k  [0805']  76.2,54.61 90 top
R7  10k  [0805']  91.44,54.61 90 top
R8  10k  [0805']  34.13,28.89 0 top
R9  100  [0805']  40.64,28.1 0 top
R10  77.48,30.48 180 top
R11  81.29,30.48 0 top
R12  10k  [0805']  20.32,16.99 0 top
R13  10k  [0805']  87,58.58 0 top
R14  57.15,30.47 180 top
R15  60.95,30.48 0 top
R16  45.72,16.51 180 top
R17  33  [0805']  91.12,17.14 0 top
R18  4k7  [0805']  38.1,39.37 90 top
R19  4k7  [0805']  35.56,39.37 90 top
R22  10k  [0805']  93.82,17.94 270 top
R43  100  [0805']  77.31,64.77 180 top
S1  17.78,34.29 0 top
U1  81.28,58.42 180 bottom
U2  37.47,36.2 0 bottom
U3  20.16,20.8 0 top
U$1  40.64,58.42 90 top
U$2  19.21,76.68 270 bottom
U$3  83.83,10.16 180 top
U$4  87.63,19.05 90 top
U$5  25.4,58.42 90 top
U$6  55.88,58.42 90 top
U$7  10.16,58.42 90 top
U$8  87.64,35.54 90 top
U$9  63.49,10.17 180 top
U$11  67.31,35.56 90 top
U$12  99.06,22.86 0 bottom
U$13  [ID_LOGO_X0.25]  1.75,29.84 0 top
U$14  67.31,19.05 90 top
U$20  [ID_LOGO_X0.25]  92.23,92.08 180 top
X1  11.75,1.75 0 top
X5  78.74,90.17 180 top
X-MOT  59.69,53.34 0 top
Y-MOT  13.97,53.34 0 top

### Tracks (layer width: path | path; a pad name or v marks a point on that pad's centre or on a via)
2  (via drill 0.3)
  Top 0.305: v31.75,30.8 31.75,30.27 R8.1
  Bottom 0.305: U2.GPIO2 29.45,31.91 30.8,31.91 31.75,30.96 v31.75,30.8
2_ENABLE  (via drill 0.3)
  Top 0.406: v68.74,51.75 80.17,51.75 83.03,54.61 84.45,54.61 86,56.15 R13.1 86,61.39 v87,62.39
  Bottom 0.406: U1.GPIO2 89.15,62.39 v87,62.39 | U$6.EN 67.31,53.18 | 67.31,53.18 65.72,51.59 55.88,51.59 53.18,54.29 | 53.18,54.29 52.07,55.4 U$1.EN | U$5.EN 36.83,55.4 37.62,54.61 | 37.62,54.61 40.64,51.59 50.32,51.59 53.02,54.29 53.18,54.29 | U$7.EN 21.59,55.4 25.24,51.75 34.92,51.75 37.62,54.45 37.62,54.61 | v68.74,51.75 67.31,53.18
3.3V  (via drill 0.3)
  Top 0.406: v90.17,32.07 90.25,32.15 U$8.1 | C3.1 68.95,31.48 v69.85,32.38 69.92,32.46 U$11.1 | U3.5 19.21,23.76 C13.2 19.58,24.82 23.34,28.57 28.2,28.57 C8.1 33.02,25.51 33.81,25.51 C16.1 35.13,25.87 R8.2 34.97,29.05 R4.2 | R4.2 34.34,31.43 C6.2 | R4.2 35.92,31.75 39.69,31.75 41.18,30.26 L1.1-VDD 43.39,30.26 R1.2 46.62,33.56 R2.2 48.94,35.88 50.8,35.88 51.28,35.4 52.7,35.4 53.98,36.67 53.98,38.73 52.34,40.37 R18.2 R19.2 | J9.2 28.57,11.27 30.32,9.53 37.15,9.53 | 37.15,9.53 40.64,9.53 J2.2 | 44.45,21.59 44.82,21.22 R16.2 40.16,16.51 37.31,13.65 37.31,9.68 37.15,9.53 | 42.31,23.42 45.24,26.35 v45.72,26.35 46.73,27.36 C2.1
  Top 0.61: 70.15,21.61 v70.17,21.59 | 48.28,21.59 44.45,21.59 44.13,21.59 42.31,23.42 40.64,25.08 34.34,25.08 C16.1 | OLED.1 33.02,25.51
  Top 0.813: 48.28,21.59 v50.16,21.59 | v70.17,21.59 U$14.VIN+ | v90.49,21.59 U$4.VIN+
  Bottom 0.406: U2.VCC 45.77,26.4 v45.72,26.35
  Bottom 0.813: v50.16,21.59 v70.17,21.59 | v70.17,21.59 v90.49,21.59 | v90.49,21.59 83.5,21.59 | v70.17,21.59 69.85,21.91 v69.85,32.38 | v90.49,21.59 90.17,21.91 v90.17,32.07
4_C-STEP  (via drill 0.3)
  Top 0.406: v84.61,58.42 82.07,58.42 79.38,61.12 79.38,67.47 v78.9,67.94 | v36.83,77.31 35.08,75.56 35.08,73.82 36.51,72.39 U$5.STEP
  Bottom 0.406: U1.GPIO4 85.62,56.62 85.09,57.15 85.09,57.94 v84.61,58.42 | v78.9,67.94 63.02,83.82 41.91,83.82 36.83,78.74 v36.83,77.31
5_D-STEP  (via drill 0.3)
  Top 0.406: v84.77,60.33 81.92,60.33 80.17,62.07 v80.17,68.9
  Bottom 0.406: U1.GPIO5 86.48,58.62 v84.77,60.33 | v80.17,68.9 80.17,69.69 64.77,85.09 29.21,85.09 22.7,78.58 22.7,77.79 21.43,76.52 20.8,76.52 20,75.72 20,73.66 21.27,72.39 U$7.STEP
5V
  Top 0.406: J1.1 86.24,71.64 D1.2
5V_SENSOR  (via drill 0.3)
  Top 0.406: v15.88,25.08 17.94,23.02 17.94,20.8 19.21,19.52 U3.1
  Top 0.61: C11.1 20.85,13.32 D3.1 19.32,14.85 R12.1 19.21,17.09 U3.1
  Bottom 0.406: J7.1 12.7,25.08 v15.88,25.08
12_FLOATS  (via drill 0.3)
  Top 0.406: J3.4 19.05,83.19 29.21,83.19 J4.4 33.02,83.19 43.18,83.19 J5.4 46.99,83.19 57.15,83.19 J6.4 60.96,83.19 62.55,83.19 64.77,80.96 64.77,74.61 v65.41,73.98
  Bottom 0.406: U1.GPIO12 73.07,62.71 74.93,62.71 76.68,64.45 76.68,66.04 69.06,73.66 66.04,73.66 65.72,73.98 v65.41,73.98
12_TEMP
  Top 0.305: R16.1 46.35,16.77 J2.5
  Bottom 0.305: U2.GPIO12 45.85,31.91 47.62,31.91 48.42,31.11 48.42,17.14 46.35,15.08 | 46.35,15.08 J2.5 | J9.5 34.13,15.72 45.56,15.72 46.2,15.08 46.35,15.08
13_WS2812  (via drill 0.3)
  Top 0.406: v75.25,64.61 76.47,64.61 R43.2
  Bottom 0.406: U1.GPIO13 v75.25,64.62 v75.25,64.61
13_WS2812_SENSOR  (via drill 0.3)
  Top 0.305: v42.7,28.73 42.07,28.1 R9.2
  Bottom 0.305: U2.GPIO13 45.76,30 43.97,30 v42.7,28.73
14_A-STEP
  Bottom 0.406: U$6.STEP 68.58,72.39 69.85,71.12 69.85,61.75 70.96,60.64 72.96,60.64 U1.GPIO14
14_SCK  (via drill 0.3)
  Top 0.305: v33.34,34.77 30.16,34.77 27.15,31.75 S1.A
  Bottom 0.305: U2.GPIO14 45.74,33.97 43.5,33.97 42.7,34.77 v33.34,34.77
15_DIR  (via drill 0.3)
  Top 0.406: v86.68,63.82 85.36,62.5 R3.2 84.09,63.5 81.44,63.5 v81.12,63.82
  Bottom 0.406: U1.GPIO15 87.48,64.62 v86.68,63.82 | v81.12,63.82 70.01,74.93 U$6.DIR 66.04,76.2 53.34,76.2 U$1.DIR 50.8,76.2 38.1,76.2 U$5.DIR 35.56,76.2 22.86,76.2 U$7.DIR
15_FF  (via drill 0.3)
  Top 0.305: R17.1 85.09,12.11 85.09,8.41 84.45,7.78 29.05,7.78 25.72,11.11 v25.72,26.83
  Bottom 0.305: v25.72,26.83 25.72,29.37 26.34,30 U2.GPIO15
16_B-STEP
  Bottom 0.406: U1.GPIO16 71.4,58.62 69.06,60.96 69.06,62.55 68.1,63.5 65.56,63.5 57.94,71.12 53.34,71.12 U$1.STEP
16_DSLEEP  (via drill 0.3)
  Top 0.305: S1.B 32.7,36.83 33.66,35.88 37.62,35.88 38.73,36.99 v42.39,36.99
  Bottom 0.305: v42.39,36.99 43.38,35.99 U2.GPIO16
+12V
  Top 0.813: U$7.VMOT 12.54,60.8 C1.+ 20.64,55.4 22.38,55.4 U$5.VMOT 27.78,60.8 C4.+ 35.88,55.4 37.62,55.4 U$1.VMOT 43.02,60.8 C5.+ 51.12,55.4 52.86,55.4 U$6.VMOT 58.26,60.8 C7.+ 66.2,55.56 68.1,55.56 69.85,57.31 69.85,67.79 74.79,72.73 D2.C
ESP_3.3V  (via drill 0.3)
  Top 0.61: C9.2 79.91,56.78 R5.2 R6.2 76.2,59.21 L2.1-VDD 72.12,63.28 C36.2 72.12,67.36 v72.71,67.94 73.82,69.06 76.04,69.06 77.47,70.48 77.47,74.14 76.68,74.93 73.03,74.93 72.71,75.25 | 91.44,58.79 C12.1 95.62,60.06 OKI.OUT | 91.44,58.79 R7.2 | R13.2 91.23,58.58 91.44,58.79 | v69.85,85.09 69.85,78.11 72.71,75.25 | U$7.VDD 10.16,71.12 22.86,71.12 U$5.VDD 25.4,71.12 38.1,71.12 U$1.VDD 40.64,71.12 53.34,71.12 U$6.VDD 55.88,71.12 68.58,71.12 72.71,75.25
  Bottom 0.61: OKI.OUT 97.31,60.96 98.9,62.55 98.9,73.82 82.55,90.17 74.93,90.17 v69.85,85.09 | v72.71,67.94 72.71,66.89 U1.VCC
ESP_FLASH  (via drill 0.3)
  Top 0.406: 91.87,53.61 R7.1 | R7.1 90.53,52.7 FLASH.1 | v92.87,56.2 92.87,54.77 91.71,53.61 R7.1
  Bottom 0.406: J1.2 85.09,62.23 86.7,60.62 U1.GPIO0 90.83,60.62 92.87,58.58 v92.87,56.2
ESP_FLASH_SENSOR  (via drill 0.3)
  Top 0.305: S1.SW+ 14.61,36.83 FLASH1.1 17.78,36.2 19.05,34.92 | v31.91,33.02 31.91,31.86 R4.1 | v26.83,35.24 26.51,35.56 22.38,35.56 21.75,34.92 19.05,34.92 | J7.2 14.61,30.16 15.56,31.11 16.51,31.11 19.05,33.66 19.05,34.92
  Bottom 0.305: v31.91,33.02 30.93,33.99 U2.GPIO0 27.6,33.99 27.3,34.29 27.3,34.77 v26.83,35.24
ESP_GND  (via drill 0.3)
  other vias: 92.55,63.02 90.17,69.06 81.76,65.72 81.76,68.9 88.42,70.8 86.52,65.25 76.36,61.28 80.01,58.58 91.28,77.63
  pour Top (isolate 0.305): 100.33,92.71 0,92.71 0,50.8 100.33,50.8
  pour Bottom (isolate 0.305): 100.33,92.71 0,92.71 0,50.8 100.33,50.8
ESP_RST  (via drill 0.3)
  Top 0.406: v77.63,52.7 77.83,52.7 R5.1 | J1.3 93.98,75.56 99.06,70.48 99.06,53.34 97.47,51.75 82.39,51.75 v82.23,51.91
  Bottom 0.406: U1.RESET 77.54,52.62 v77.63,52.7 81.44,52.7 v82.23,51.91
ESP_RST_SENSOR  (via drill 0.3)
  Top 0.305: v50.01,34.92 48.62,33.54 R1.1 | J7.3 10.32,21.91 8.57,23.65 8.57,37.62 9.53,38.58 20,38.58 23.65,42.23 v41.91,42.23
  Bottom 0.305: v50.01,34.92 50.01,35.88 49.21,36.67 49.21,40.32 47.62,41.91 45.85,41.91 U2.RESET 42.14,41.99 v41.91,42.23
ESP_RX
  Bottom 0.406: J1.4 83.34,75.09 83.34,54.77 85.49,52.62 U1.TXD0
ESP_RX_SENSOR  (via drill 0.3)
  Top 0.305: v22.54,38.42 25.4,41.27 v25.56,41.27
  Bottom 0.305: J7.4 22.54,28.57 v22.54,38.42 | v25.56,41.27 26.28,41.99 U2.TXD0
ESP_TX
  Bottom 0.406: J1.5 91.6,74.14 91.6,70.01 93.82,67.79 93.82,55.56 92.88,54.62 U1.RXD0
ESP_TX_SENSOR
  Bottom 0.305: J7.5 9.05,22.38 9.05,32.86 10.64,34.45 16.19,34.45 21.74,39.99 U2.RXD0
GND  (via drill 0.3)
  Top 0.406: v89.53,39.05 90.25,38.33 U$8.4 90.23,37.47 89.22,37.47 88.58,36.83 88.58,31.17 | v74.61,39.05 73.66,38.1 | 73.66,38.1 70.56,38.1 U$11.4 | C3.2 70.75,30.75 73.66,33.66 73.66,38.1 | v52.07,33.34 52.07,32.38 50.43,30.75 C2.2
  Top 0.61: v91.76,23.18 91.76,27.99 88.58,31.17
  Top 0.813: 91.76,20.64 v91.76,23.18 | Q3.2 94.56,20.27 | 94.56,20.27 C14.- | 94.56,20.27 94.48,20.34 | 94.48,20.34 94.19,20.64 91.76,20.64 | R22.1 94.48,19.6 94.48,20.34 | J2.6 53.34,11.43 54.61,12.7 62.23,12.7 65.72,16.19 | 91.76,20.64 90.17,19.05 U$4.VIN- 81.28,12.7 68.9,12.7 65.72,15.88 65.72,16.19 | 65.72,16.19 67.31,17.78 U$14.VIN-
  Bottom 0.406: v89.53,39.05 v74.61,39.05 74.3,38.73 69.22,38.73 68.58,39.37 50.8,39.37 50.16,38.73 50.16,36.83 52.07,34.92 v52.07,33.34
  other vias: 12.7,35.56 32.38,27.15 20.48,30.32 23.34,24.29 28.73,24.45 36.67,26.99 39.85,26.19 40.64,33.02 45.72,23.81
  pour Top (isolate 0.406): 0,0 49.53,0 49.53,43.18 0,43.18
  pour Bottom (isolate 0.406): 0,0 49.53,0 49.53,43.18 0,43.18
N$1  (via drill 0.3)
  Top 0.406: v75.56,54.29 75.56,54.24 R6.1
  Bottom 0.406: U1.CH_PD 74.83,56.62 75.25,56.2 75.25,54.61 v75.56,54.29
N$2
  Bottom 0.406: EC.PRB 78.75,15.23 U$3.S
N$3
  Top 0.813: D4.A 80.01,80.33 X5.1 74.93,77.79 D2.A
N$4
  Bottom 0.406: EC1.PRB 58.41,15.21 U$9.S
N$5
  Bottom 0.406: EC1.PRA 60.95,15.21 U$9.GND
N$6
  Top 0.406: R15.1 60.05,32.1 EC1.RX 60.96,35.01 62.15,36.2 U$11.6
N$7  (via drill 0.3)
  Top 0.406: R14.1 58.05,32.63 EC1.TX | U$11.7 v62.55,34.92
  Bottom 0.406: v62.55,34.92 60.34,34.92 EC1.TX
N$8
  Bottom 0.406: EC.PRA 81.29,15.23 U$3.GND
N$9
  Bottom 0.406: U$1.RST U$1.SLP
N$10  (via drill 0.3)
  Top 0.305: v48.26,37.31 48.26,36.83 46.99,35.56 R2.1
  Bottom 0.305: U2.CH_PD 45.82,37.94 47.62,37.94 v48.26,37.31
N$11
  Top 0.305: R9.1 38.03,29.71 L1.4-DIN
N$12
  Top 0.406: R11.1 80.39,32.15 EC.RX 81.27,34.91 82.55,36.2 85,36.2 U$8.6
N$13
  Top 0.305: U3.3 21.32,19.29 R12.2
N$14  (via drill 0.3)
  Top 0.406: R10.1 78.38,32.68 EC.TX | U$8.7 85,34.92 v83.19,34.92
  Bottom 0.406: v83.19,34.92 80.62,34.92 EC.TX
N$15
  Top 0.406: C21.2 73.42,30.27 EC.GND 80.59,37.44 U$8.5 85.02,38.95 C20.2 85.44,39.73 86.36,40.64 87.95,40.64 88.27,40.32 88.27,38.42 87.63,37.78 87.63,33.34 85.91,31.62 C19.1 87.63,28.77 U$4.VOUT-
N$16
  Top 0.406: R11.2 83,31.3 | 83,31.3 83.19,31.48 83.19,33.34 83.48,33.63 U$8.8 | 85.05,33.66 U$8.8 | C20.1 86.68,38.8 86.68,33.97 86.34,33.63 U$8.8 | C21.1 76.58,28.02 R10.2 | 78.73,26.66 C21.1 | EC.VCC 75.22,16.22 C21.1 | 83,31.3 83.3,31.3 C19.2 80.29,26.67 78.74,26.67 78.73,26.66 | U$4.VOUT+ 78.73,26.67 78.73,26.66
N$17
  Top 0.406: C25.2 53.09,30.21 EC1.GND 60.34,37.46 U$11.5 64.69,38.93 C24.2 65.13,39.97 65.8,40.64 67.55,40.64 68.1,40.08 68.1,33.01 C23.1 67.31,28.77 U$14.VOUT-
N$18
  Bottom 0.61: U$1.2B 41.91,59.69 E0-MOT.1
N$19
  Top 0.406: Q3.1 97.95,18.73 97,17.78 94.66,17.78 R22.2 92.33,16.94 R17.2
N$20
  Bottom 0.406: U$6.RST U$6.SLP
N$21
  Bottom 0.61: U$1.2A 44.45,59.69 E0-MOT.2
N$22
  Bottom 0.61: U$1.1A 46.99,59.69 E0-MOT.3
N$23
  Bottom 0.406: U$7.RST U$7.SLP
N$24
  Bottom 0.406: U$5.RST U$5.SLP
N$25
  Top 0.406: 62.87,31.5 62.87,33.34 63.18,33.65 U$11.8 66.04,33.66 66.93,34.54 C24.1 | 62.87,31.5 R15.2 | 54.88,26.69 C25.1 | EC1.VCC 54.88,16.23 C25.1 | C25.1 56.02,27.8 | 56.02,27.8 56.25,28.03 R14.2 | 62.87,31.5 62.87,31.41 C23.2 59.98,26.69 57.78,26.69 U$14.VOUT+ 57.15,26.67 56.02,27.8
N$26
  Bottom 0.61: U$1.1B 49.53,59.69 E0-MOT.4
N$27
  Bottom 0.61: U$5.2B 26.67,59.69 E1-MOT.1
N$28
  Bottom 0.61: U$5.2A 29.21,59.69 E1-MOT.2
N$29
  Top 0.61: J8.2 96.34,12.52 D5.A 97,14.47 Q3.3
N$32
  Bottom 0.61: U$5.1A 31.75,59.69 E1-MOT.3
N$36
  Bottom 0.61: U$5.1B 34.29,59.69 E1-MOT.4
N$37
  Bottom 0.61: U$6.2B 57.15,59.69 X-MOT.1
N$38
  Bottom 0.61: U$6.2A 59.69,59.69 X-MOT.2
N$39
  Bottom 0.61: U$6.1A 62.23,59.69 X-MOT.3
N$40
  Bottom 0.61: U$6.1B 64.77,59.69 X-MOT.4
N$41
  Bottom 0.61: U$7.2B 11.43,59.69 Y-MOT.1
N$42
  Bottom 0.61: U$7.2A 13.97,59.69 Y-MOT.2
N$43
  Bottom 0.61: U$7.1A 16.51,59.69 Y-MOT.3
N$44
  Bottom 0.61: U$7.1B 19.05,59.69 Y-MOT.4
N$45
  Top 0.61: F1.2 86.86,67.44 C10.1 95.12,67.44 OKI.IN
N$74
  Top 0.406: R43.1 78.27,64.77 L2.4-DIN
PROBE_SCL  (via drill 0.3)
  Top 0.305: v34.13,37.15 36.88,37.15 R18.1 38.37,38.1 v51.75,38.1
  Top 0.406: v92.08,37.15 92.08,36.83 91.42,36.17 U$8.3 | U$11.3 71.44,36.2 71.75,36.51 v71.75,37.15
  Bottom 0.305: U2.GPIO5 32.98,35.99 | 32.98,35.99 v34.13,37.15 | 32.98,35.99 32.54,35.56 32.54,34.13 38.1,28.57 OLED.3
  Bottom 0.406: v51.75,38.1 52.07,37.78 71.12,37.78 | 71.12,37.78 91.44,37.78 v92.08,37.15 | v71.75,37.15 71.12,37.78
PROBE_SDA  (via drill 0.3)
  Top 0.305: v33.34,38.26 35.45,38.26 R19.1 36.15,38.37 36.99,39.21 52.07,39.21 52.7,38.58 v52.7,36.83
  Top 0.406: v92.71,35.56 92.71,35.24 92.37,34.9 U$8.2 | U$11.2 72.39,34.92 72.71,35.24 v72.71,35.56
  Bottom 0.305: v33.34,38.26 33.07,37.99 U2.GPIO4 26.77,37.99 26.51,38.26 24.29,38.26 23.5,37.47 23.5,27.15 32.07,18.57 38.89,18.57 OLED.4
  Bottom 0.406: v52.7,36.83 53.34,36.2 72.07,36.2 | 72.07,36.2 92.08,36.2 v92.71,35.56 | v72.71,35.56 72.07,36.2
VCC
  Top 0.61: D4.C 83.94,68.8 D1.1 84.24,68.28 F1.1
VCC_SENSOR
  Top 0.61: J8.1 91.94,10.66 D5.C | C14.+ 99.22,21.01 99.22,10.95 96.36,8.1 92.55,8.1 91.44,9.21 J8.1 | J8.1 88.9,7.62 86.68,7.62 80.64,1.59 20,1.59 19.05,2.54 19.05,11.78 17.95,12.87 | D3.2 17.9,12.93 17.95,12.87 | X1.1 15.4,10.32 17.95,12.87

### Text on the board
tPlace: 4k7 | FLASH | 4k7 | Rx | Tx
bPlace: 6/25/17 | Dose Control v1 / GroBotics.io | 6/24/17 | Water Quality v1 / Grobotics.io